# EAGLE schematic FRDM-Motor_v1 (EAGLE 6.4)
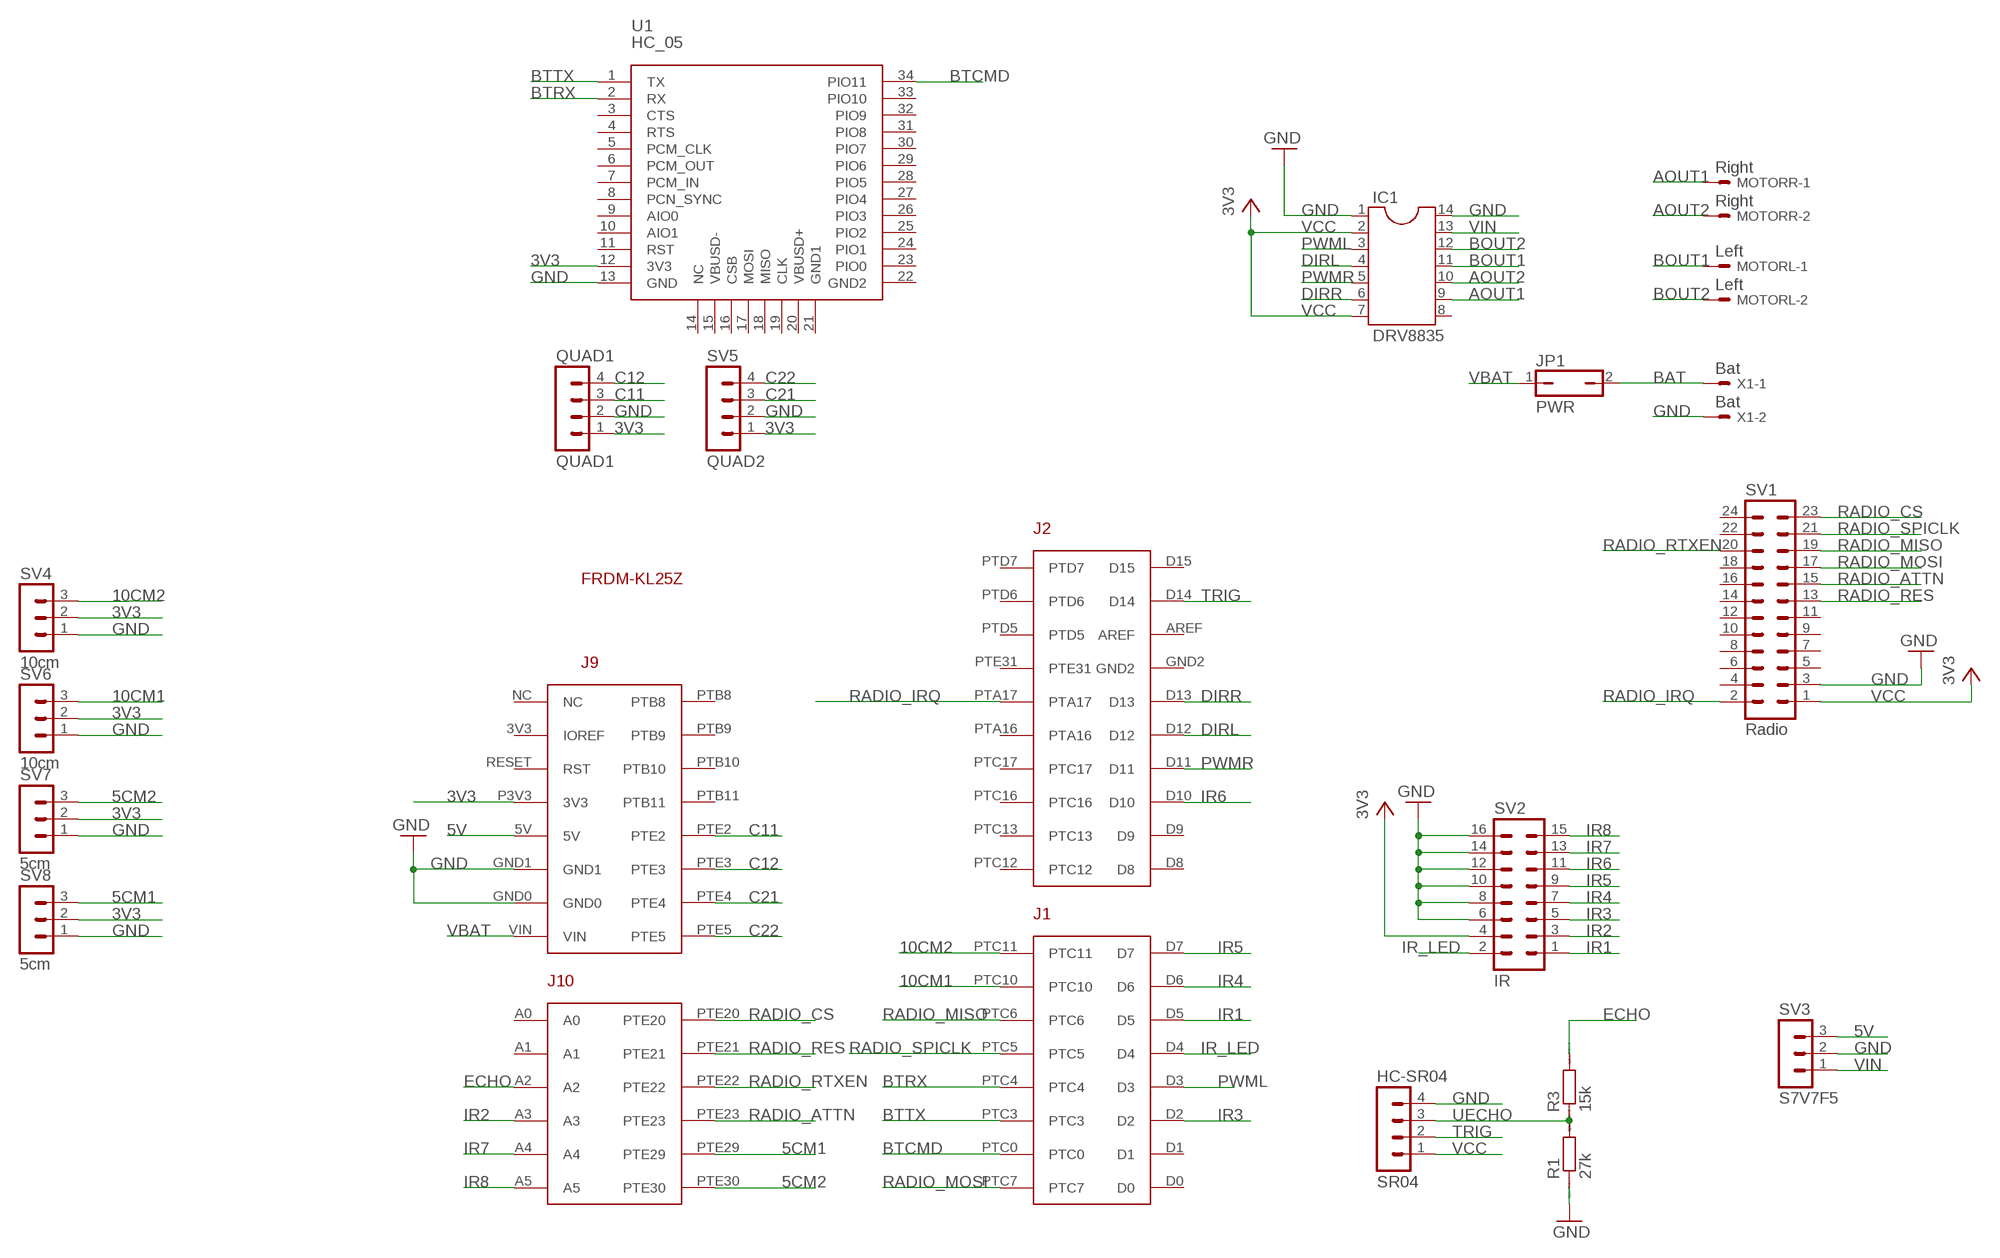
[diagram p0: schematic, sheet 1]

## Parts
FRDM1  FRDM-KL25ZARDUINO  [FRDM-KL25Z]
HC-SR04  SR04  MA04-1  [MA04-1]
IC1  DRV8835  DIL14  [DIL14]
JP1  PWR  JP1Q  [JP1]
MOTORL  Left  KK-156-2  [KK-156-2]
MOTORR  Right  KK-156-2  [KK-156-2]
QUAD1  QUAD1  MA04-1  [MA04-1]
R1  27k  R  [R0805]
R3  15k  R  [R0805]
SV1  Radio  MA12-2  [MA12-2]
SV2  IR  MA08-2  [MA08-2]
SV3  S7V7F5  MA03-1  [MA03-1]
SV4  10cm  MA03-1  [MA03-1]
SV5  QUAD2  MA04-1  [MA04-1]
SV6  10cm  MA03-1  [MA03-1]
SV7  5cm  MA03-1  [MA03-1]
SV8  5cm  MA03-1  [MA03-1]
U1  HC_05  [BLUETOOTH_SMD]
X1  Bat  KK-156-2  [KK-156-2]

## Nets
3V3: FRDM1.P3V3(3V3) QUAD1.1 SV4.2 SV5.1 SV6.2 SV7.2 SV8.2 U1.12(3V3)
5CM1: FRDM1.PTE29 SV8.3
5CM2: FRDM1.PTE30 SV7.3
5V: FRDM1.5V SV3.3
10CM1: FRDM1.PTC10 SV6.3
10CM2: FRDM1.PTC11 SV4.3
AOUT1: IC1.9 MOTORR.1
AOUT2: IC1.10 MOTORR.2
BAT: JP1.2 X1.1
BOUT1: IC1.11 MOTORL.1
BOUT2: IC1.12 MOTORL.2
BTCMD: FRDM1.PTC0 U1.34(PIO11)
BTRX: FRDM1.PTC4 U1.2(RX)
BTTX: FRDM1.PTC3 U1.1(TX)
C11: FRDM1.PTE2 QUAD1.3
C12: FRDM1.PTE3 QUAD1.4
C21: FRDM1.PTE4 SV5.3
C22: FRDM1.PTE5 SV5.4
DIRL: FRDM1.D12 IC1.4
DIRR: FRDM1.D13 IC1.6
ECHO: FRDM1.A2 R3.2
GND: FRDM1.GND0 FRDM1.GND1 HC-SR04.4 IC1.1 IC1.14 QUAD1.2 R1.1 SV1.3 SV2.6 SV2.8 SV2.10 SV2.12 SV2.14 SV2.16 SV3.2 SV4.1 SV5.2 SV6.1 SV7.1 SV8.1 U1.13(GND) X1.2
IR1: FRDM1.D5 SV2.1
IR2: FRDM1.A3 SV2.3
IR3: FRDM1.D2 SV2.5
IR4: FRDM1.D6 SV2.7
IR5: FRDM1.D7 SV2.9
IR6: FRDM1.D10 SV2.11
IR7: FRDM1.A4 SV2.13
IR8: FRDM1.A5 SV2.15
IR_LED: FRDM1.D4 SV2.2
PWML: FRDM1.D3 IC1.3
PWMR: FRDM1.D11 IC1.5
RADIO_ATTN: FRDM1.PTE23 SV1.15
RADIO_CS: FRDM1.PTE20 SV1.23
RADIO_IRQ: FRDM1.PTA17 SV1.2
RADIO_MISO: FRDM1.PTC6 SV1.19
RADIO_MOSI: FRDM1.PTC7 SV1.17
RADIO_RES: FRDM1.PTE21 SV1.13
RADIO_RTXEN: FRDM1.PTE22 SV1.20
RADIO_SPICLK: FRDM1.PTC5 SV1.21
TRIG: FRDM1.D14 HC-SR04.2
UECHO: HC-SR04.3 R1.2 R3.1
VBAT: FRDM1.VIN JP1.1
VCC: HC-SR04.1 IC1.2 IC1.7 SV1.1 SV2.4 ; supply symbol labelled 3V3
VIN: IC1.13 SV3.1
Unconnected: FRDM1.3V3(IOREF) FRDM1.A0 FRDM1.A1 FRDM1.AREF FRDM1.D0 FRDM1.D1 FRDM1.D8 FRDM1.D9 FRDM1.D15 FRDM1.GND2 FRDM1.NC FRDM1.PTA16 FRDM1.PTB8 FRDM1.PTB9 FRDM1.PTB10 FRDM1.PTB11 FRDM1.PTC12 FRDM1.PTC13 FRDM1.PTC16 FRDM1.PTC17 FRDM1.PTD5 FRDM1.PTD6 FRDM1.PTD7 FRDM1.PTE31 FRDM1.RESET(RST) IC1.8 SV1.4 SV1.5 SV1.6 SV1.7 SV1.8 SV1.9 SV1.10 SV1.11 SV1.12 SV1.14 SV1.16 SV1.18 SV1.22 SV1.24 U1.3(CTS) U1.4(RTS) U1.5(PCM_CLK) U1.6(PCM_OUT) U1.7(PCM_IN) U1.8(PCN_SYNC) U1.9(AIO0) U1.10(AIO1) U1.11(RST) U1.14(NC) U1.15(VBUSD-) U1.16(CSB) U1.17(MOSI) U1.18(MISO) U1.19(CLK) U1.20(VBUSD+) U1.21(GND1) U1.22(GND2) U1.23(PIO0) U1.24(PIO1) U1.25(PIO2) U1.26(PIO3) U1.27(PIO4) U1.28(PIO5) U1.29(PIO6) U1.30(PIO7) U1.31(PIO8) U1.32(PIO9) U1.33(PIO10)

## Library data of the parts
FRDM1 = Freedom:FRDM-KL25Z: For creating FRDM-KL25Z shields
HC-SR04 QUAD1 SV5 = con-lstb:MA04-1: PIN HEADER; OC_FARNELL: unknown; OC_NEWARK: unknown
IC1 = ic-package:DIL14: Dual In Line / Socket
JP1 = jumper:JP1Q: JUMPER
MOTORL MOTORR X1 = con-molex:KK-156-2: KK 156 HEADER Source: http://www.molex.com/pdm_docs/sd/026604100_sd.pdf; OC_FARNELL: unknown; OC_NEWARK: unknown
R1 R3 = eagle-ltspice:R: RESISTOR, European symbol; SPICEMODEL: NONE; SPICEPREFIX: R
SV1 = con-lstb:MA12-2: PIN HEADER; OC_FARNELL: unknown; OC_NEWARK: unknown
SV2 = con-lstb:MA08-2: PIN HEADER; OC_FARNELL: unknown; OC_NEWARK: unknown
SV3 SV4 SV6-SV8 = con-lstb:MA03-1: PIN HEADER; OC_FARNELL: unknown; OC_NEWARK: unknown
U1 = Bluetooth HC-05:HC_05: HC-05 Bluetooth Module